# Altium project pi_powersupply.PrjPCB
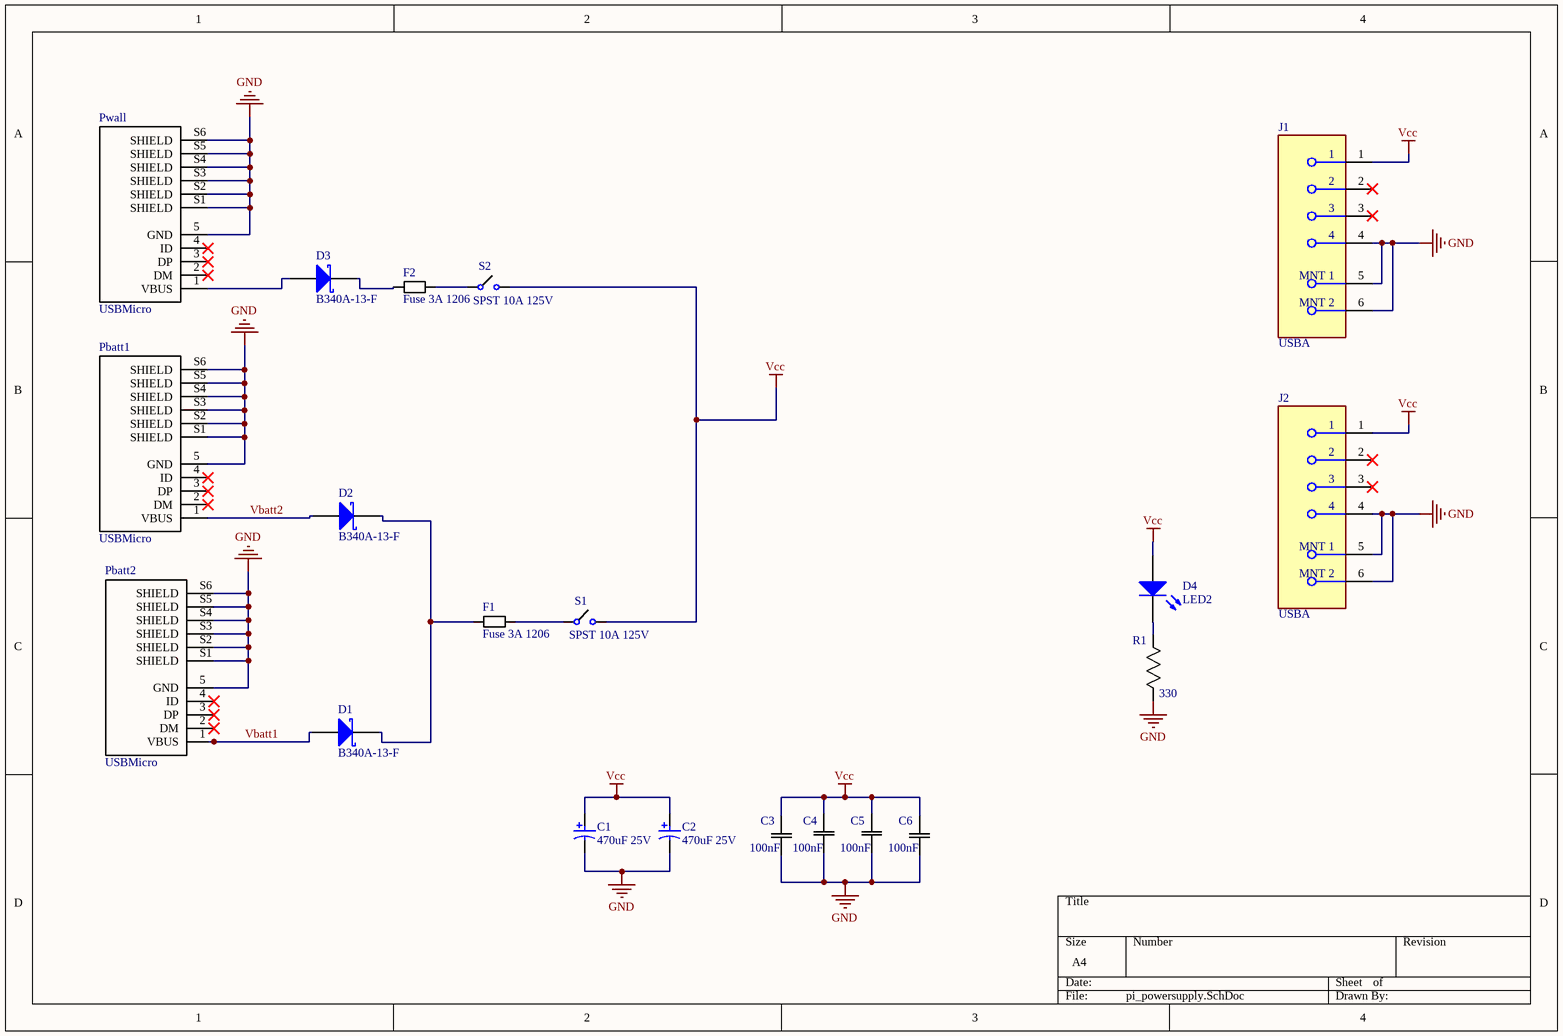
[diagram p0: pi_powersupply.SchDoc]
1 sheet, 20 parts. Net scope: global (net labels, ports and power ports of the same name join across sheets).
Board file: pi_powersupply.PcbDoc

## Sheet pi_powersupply.SchDoc
size A4

### Parts
C1  470uF 25V  [NIC-CAPA2-10X10_V]
C2  470uF 25V  [NIC-CAPA2-10X10_V]
C3  100nF  [0805]
C4  100nF  [0805]
C5  100nF  [0805]
C6  100nF  [0805]
D1  B340A-13-F  [DIOD-SMA-2_V]
D2  B340A-13-F  [DIOD-SMA-2_V]
D3  B340A-13-F  [DIOD-SMA-2_V]
D4  LED2  [3.2X1.6X1.1]
F1  Fuse 3A 1206  [1206]
F2  Fuse 3A 1206  [1206]
J1  USBA  [TE_Connectivity_292303-4_MFG]
J2  USBA  [TE_Connectivity_292303-4_MFG]
Pbatt1  USBMicro  [USB Micro B Receptacle]
Pbatt2  USBMicro  [USB Micro B Receptacle]
Pwall  USBMicro  [USB Micro B Receptacle]
R1  330  [0805]
S1  SPST 10A 125V  [SWITCH ROCKER SPST 10A 125V]
S2  SPST 10A 125V  [SWITCH ROCKER SPST 10A 125V]

### Nets
GND: C1.2 C2.2 C3.1(C1) C4.1(C1) C5.1(C1) C6.1(C1) J1.4 J1.5(MNT_1) J1.6(MNT_2) J2.4 J2.5(MNT_1) J2.6(MNT_2) Pbatt1.5(GND) Pbatt1.S1(SHIELD) Pbatt1.S2(SHIELD) Pbatt1.S3(SHIELD) Pbatt1.S4(SHIELD) Pbatt1.S5(SHIELD) Pbatt1.S6(SHIELD) Pbatt2.5(GND) Pbatt2.S1(SHIELD) Pbatt2.S2(SHIELD) Pbatt2.S3(SHIELD) Pbatt2.S4(SHIELD) Pbatt2.S5(SHIELD) Pbatt2.S6(SHIELD) Pwall.5(GND) Pwall.S1(SHIELD) Pwall.S2(SHIELD) Pwall.S3(SHIELD) Pwall.S4(SHIELD) Pwall.S5(SHIELD) Pwall.S6(SHIELD) R1.2(R2)
Vcc: C1.1 C2.1 C3.2(C2) C4.2(C2) C5.2(C2) C6.2(C2) D4.1(A) J1.1 J2.1 S1.1 S2.1
Vbatt1: D1.1(A) Pbatt2.1(VBUS)
Vbatt2: D2.1(A) Pbatt1.1(VBUS)
NetD1_2: D1.2(K) D2.2(K) F1.1
NetD3_1: D3.1(A) Pwall.1(VBUS)
NetD3_2: D3.2(K) F2.1
NetD4_2: D4.2(K) R1.1(R1)
NetF1_2: F1.2 S1.0
NetF2_2: F2.2 S2.0

Not connected (* = marked no-connect by the designer): J1 2* 3*; J2 2* 3*; Pbatt1 2(DM)* 3(DP)* 4(ID)*; Pbatt2 2(DM)* 3(DP)* 4(ID)*; Pwall 2(DM)* 3(DP)* 4(ID)*

### Library data of the parts
C1 C2 = CMP-0687-00002-1: Aluminum Electrolytic Capacitor, UD Series, Low Impedance, 470 uF, 25 V, + / - 20%, -55 to 105 degC, Chip Type, 10 x 10 mm D x L, Pb-Free, Reel; PartNumber: UUD1E471MNL1GS; Manufacturer: Nichicon; Impedance: 0.09 Ohm; Endurance Time: 5000 h; Rated Ripple Current (at 100kHz): 670 mA; Packing: Dia382mm Reel; Tolerance Rated Capacitance: -20 to 20%; ComponentLink3URL: http://products.nichicon.co.jp/en/pdf/XJA043/e-ud.pdf; ComponentLink2URL: http://products.nichicon.co.jp/en/pdf/XJA043/e-ud.pdf; Length: 10 mm; ComponentLink3Description: Package Specification; PackageReference: CAPAE-D10H10; ComponentLink1URL: http://www.nichicon.co.jp/; DatasheetVersion: 08/2012; Rated Capacitance: 470 uF; Rated Voltage: 25 V; ComponentLink1Description: Manufacturer URL; ComponentLink2Description: Datasheet; Diameter: 10 mm; PackageDescription: 2-Pin Surface Mount Device, Diameter 10 mm, Height 10 mm, Pitch 8 mm; RoHS: TRUE; Mounting Technology: Surface Mount; Digikey: 493-6386-2-ND
C3-C6 = CAP 100nF 0805: CAP CER 0.1UF 50V X7R 0805; MP: CC0805KRX7R9BB104; MF: Yageo; Tolerance: 10%; Package: 0805; Price: 0,119 CAD; Value: 100nF; Digikey: 311-1140-1-ND; Digikey Link: https://www.digikey.ca/products/en?keywords=311-1140-1-ND; Rating: 50V
D1-D3 = CMP-1667-00003-1: Surface Mount Schottky Barrier Rectifier, 40 V, 3 A, -55 to 150 degC, 2-Pin SMA, RoHS, Tape and Reel; Forward Current: 3 A; Forward Voltage: 500 mV; Max Surge Current: 80 A; Peak Reverse Current: 500 uA; Elements: 1; Mounting Technology: Surface Mount; ComponentLink1URL: http://www.diodes.com/; PackageDescription: 2-Pin Surface Mounted Assembly, Body 4.3 x 2.605 mm, Height 2.4 mm; Min Operating Temperature: -55 degC; Mount: Surface Mount; Pins: 2; ComponentLink2URL: http://www.diodes.com/_files/datasheets/ds30891.pdf; PackageReference: SMA-2; Max Operating Temperature: 125 degC; Radiation Hardening: No; Length: 4.6 mm; RoHSCompliant: true; ComponentLink1Description: Manufacturer URL; Height: 2.1 mm; ComponentLink2Description: Datasheet; Packaging: Tape and Reel; Package Quantity: 5000; Case\Package: SMA; DatasheetVersion: Rev. 17 - 2, 09/2015; REACH SVHC: No SVHC; Width: 2.92 mm
D4 = LED RED SMD: Typical RED, GREEN, YELLOW, AMBER GaAs LED; MF: Lite-On Inc.; MP: LTST-C190CKT; Rating: 1.8V; Digikey: 160-1181-1-ND; Digikey Link: https://www.digikey.ca/products/en?keywords=160-1181-1-ND; Package: 0603
F1 F2 = Fuse 3A 1206: FUSE 3.0A 63VAC/DC SLOW 1206; MF: Bel Fuse Inc.; MP: 0685T3000-01; Digikey: 507-1896-6-ND; Rating: 3A; Digikey Link: https://www.digikey.ca/product-detail/en/bel-fuse-inc/0685T3000-01/507-1896-6-ND/4968212
J1 J2 = CMP-03205-00081-1: CONN RCPT USB2.0 TYPEA 4POS R/A; Manufacturer: TE Connectivity; Number Of Contacts: 4; Voltage Rating: 30V; Shielding: true; Current Rating: 1A; Conn Orientation: Right Angle; Is Female: yes; Part Number: 292303-4; Temperature Range Low: -55°C; Temperature Range High: +85°C; Automotive: No; Lead Free: Yes; ComponentLink1URL: https://www.te.com/usa-en/product-292303-4.html?te_bu=Cor&te_type=other&te_campaign=oct_glo_cor-oct-global-oth-prtnr-fy19-oct-octo-buy-bom_sma-298_2&elqCampaignId=35216; Usb Standard: USB 2.0; Package: 292303-4; Temperature: -55°C to +85°C; ComponentLink1Description: Datasheet; RoHS: TRUE; Contact Material: Gold,Nickel
Pbatt1 Pbatt2 Pwall = USB Micro B Receptacle: USB - micro B USB 2.0 Receptacle Connector 5 Position Surface Mount, Right Angle; Through Hole; MF: Amphenol ICC (FCI); MP: 10118194-0001LF; Rating: 100VAC 1.8A; Digikey: 609-4618-1-ND; Digikey Link: https://www.digikey.ca/product-detail/en/amphenol-icc-fci/10118194-0001LF/609-4618-1-ND/2785382; Price: 0.62000 CAD; ComponentLink1Description: Digikey; ComponentLink1URL: https://www.digikey.ca/product-detail/en/amphenol-icc-fci/10118194-0001LF/609-4618-1-ND/2785382; ComponentLink2Description: Datasheet; ComponentLink2URL: https://www.digikey.ca/en/datasheets/amphenol-fci/amphenol-fci-io-usb-micro
R1 = RES 330 0805: RES SMD 330 OHM 1% 1/8W 0805; MP: RC0805FR-07330RL; MF: Yageo; Rating: 0.125W; Digikey: 311-330CRCT-ND; Price: 0.061 CAD; Package: 0805; Value: 330; Digikey Link: https://www.digikey.ca/products/en?keywords=311-330CRCT-ND
S1 S2 = SW ROCKER: Rocker Switch SPST 10A (AC) 125V Panel Mount, Snap-In; MP: SRB22A2FBBNN; MF: ZF Electronics; Digikey: CH755-ND; Digikey Link: https://www.digikey.ca/product-detail/en/zf-electronics/SRB22A2FBBNN/CH755-ND/446021; Price: 1.276 CAD; Rating: 10A 125V; ComponentLink1Description: Digikey; ComponentLink1URL: https://www.digikey.ca/product-detail/en/zf-electronics/SRB22A2FBBNN/CH755-ND/446021; ComponentLink2Description: Datasheet; ComponentLink2URL: http://switches-sensors.zf.com/us/wp-content/uploads/sites/7/2012/10/Rocker_SRB_Datasheet1.pdf